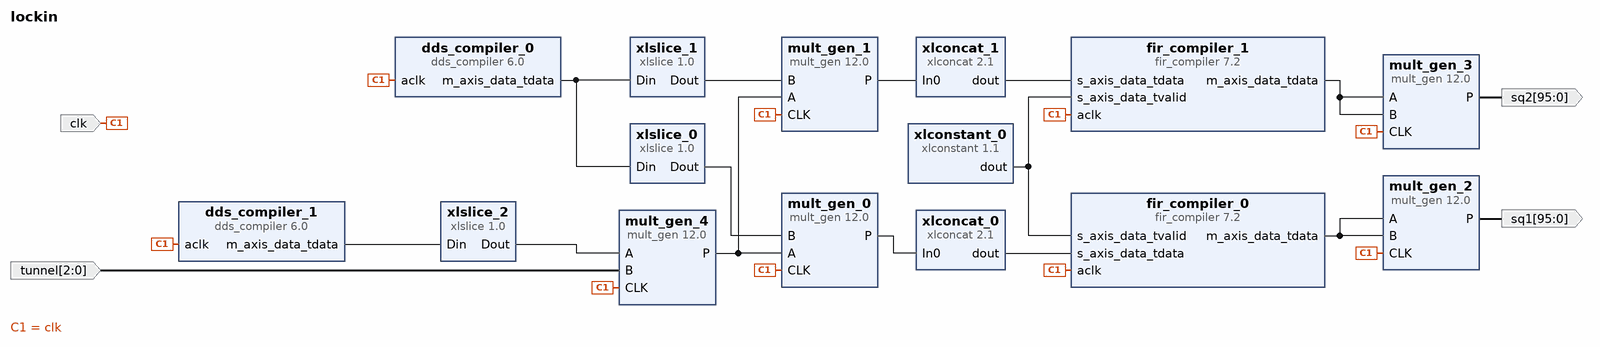
[diagram p0: block diagram of the top level]
# Vivado block design lockin, xc7k70tfbv676-1, Vivado 2017.2
create_bd_design lockin

create_bd_port -dir I -type clk clk
set_property -dict {CONFIG.FREQ_HZ 100000000} [get_bd_ports clk]
create_bd_port -dir O -from 95 -to 0 sq1
create_bd_port -dir O -from 95 -to 0 sq2
create_bd_port -dir I -from 2 -to 0 tunnel

create_bd_cell -type ip -vlnv xilinx.com:ip:dds_compiler:6.0 dds_compiler_0
set_property -dict [list \
  CONFIG.PartsPresent Phase_Generator_and_SIN_COS_LUT \
  CONFIG.Parameter_Entry Hardware_Parameters \
  CONFIG.Noise_Shaping None \
  CONFIG.Phase_Width 16 \
  CONFIG.Output_Width 14 \
  CONFIG.Phase_Increment Fixed \
  CONFIG.Has_Phase_Out true \
  CONFIG.DATA_Has_TLAST Not_Required \
  CONFIG.S_PHASE_Has_TUSER Not_Required \
  CONFIG.M_DATA_Has_TUSER Not_Required \
  CONFIG.Latency 7 \
  CONFIG.Output_Frequency1 0 \
  CONFIG.PINC1 1100110011010 \
] [get_bd_cells dds_compiler_0]
create_bd_cell -type ip -vlnv xilinx.com:ip:xlslice:1.0 xlslice_0
set_property -dict {CONFIG.DIN_TO 16 CONFIG.DIN_FROM 29 CONFIG.DOUT_WIDTH 14} [get_bd_cells xlslice_0]
create_bd_cell -type ip -vlnv xilinx.com:ip:xlslice:1.0 xlslice_1
set_property -dict {CONFIG.DIN_FROM 13 CONFIG.DOUT_WIDTH 14} [get_bd_cells xlslice_1]
create_bd_cell -type ip -vlnv xilinx.com:ip:mult_gen:12.0 mult_gen_0
set_property -dict [list \
  CONFIG.MultType Parallel_Multiplier \
  CONFIG.PortAWidth 14 \
  CONFIG.PortBWidth 14 \
  CONFIG.OptGoal Speed \
] [get_bd_cells mult_gen_0]
create_bd_cell -type ip -vlnv xilinx.com:ip:mult_gen:12.0 mult_gen_1
set_property -dict {CONFIG.PortAWidth 14 CONFIG.PortBWidth 14} [get_bd_cells mult_gen_1]
create_bd_cell -type ip -vlnv xilinx.com:ip:fir_compiler:7.2 fir_compiler_0
set_property -dict [list \
  CONFIG.CoefficientSource COE_File \
  CONFIG.Coefficient_File filtercoeff.coe \
  CONFIG.Coefficient_Sets 1 \
  CONFIG.Coefficient_Reload false \
  CONFIG.RateSpecification Frequency_Specification \
  CONFIG.SamplePeriod 1 \
  CONFIG.Sample_Frequency 100 \
  CONFIG.Clock_Frequency 100 \
  CONFIG.Coefficient_Sign Unsigned \
  CONFIG.Quantization Quantize_Only \
  CONFIG.Coefficient_Width 16 \
  CONFIG.Coefficient_Fractional_Bits 18 \
  CONFIG.Coefficient_Structure Inferred \
  CONFIG.Data_Sign Signed \
  CONFIG.Data_Width 28 \
  CONFIG.Data_Fractional_Bits 0 \
  CONFIG.Output_Rounding_Mode Full_Precision \
  CONFIG.Output_Width 47 \
  CONFIG.Filter_Architecture Systolic_Multiply_Accumulate \
  CONFIG.Optimization_Goal Speed \
  CONFIG.Optimization_Selection All \
  CONFIG.Optimization_List Data_Path_Fanout,Pre-Adder_Pipeline,Coefficient_Fanout,Control_Path_Fanout,Control_Column_Fanout,Control_Broadcast_Fanout,Control_LUT_Pipeline,No_BRAM_Read_First_Mode,Optimal_Column_Lengths,Other \
  CONFIG.ColumnConfig 5 \
] [get_bd_cells fir_compiler_0]
create_bd_cell -type ip -vlnv xilinx.com:ip:fir_compiler:7.2 fir_compiler_1
set_property -dict [list \
  CONFIG.CoefficientSource COE_File \
  CONFIG.Coefficient_File filtercoeff.coe \
  CONFIG.Coefficient_Sets 1 \
  CONFIG.Sample_Frequency 100 \
  CONFIG.Clock_Frequency 100 \
  CONFIG.Coefficient_Sign Unsigned \
  CONFIG.Quantization Quantize_Only \
  CONFIG.Coefficient_Width 16 \
  CONFIG.Coefficient_Fractional_Bits 18 \
  CONFIG.Coefficient_Structure Inferred \
  CONFIG.Data_Width 28 \
  CONFIG.Output_Rounding_Mode Full_Precision \
  CONFIG.Output_Width 47 \
  CONFIG.Filter_Architecture Systolic_Multiply_Accumulate \
  CONFIG.Optimization_Goal Speed \
  CONFIG.Optimization_Selection All \
  CONFIG.Optimization_List Data_Path_Fanout,Pre-Adder_Pipeline,Coefficient_Fanout,Control_Path_Fanout,Control_Column_Fanout,Control_Broadcast_Fanout,Control_LUT_Pipeline,No_BRAM_Read_First_Mode,Optimal_Column_Lengths,Other \
  CONFIG.ColumnConfig 5 \
] [get_bd_cells fir_compiler_1]
create_bd_cell -type ip -vlnv xilinx.com:ip:mult_gen:12.0 mult_gen_2
set_property -dict {CONFIG.PortAWidth 48 CONFIG.PortBWidth 48} [get_bd_cells mult_gen_2]
create_bd_cell -type ip -vlnv xilinx.com:ip:mult_gen:12.0 mult_gen_3
set_property -dict {CONFIG.PortAWidth 48 CONFIG.PortBWidth 48} [get_bd_cells mult_gen_3]
create_bd_cell -type ip -vlnv xilinx.com:ip:mult_gen:12.0 mult_gen_4
set_property -dict {CONFIG.PortAWidth 11 CONFIG.PortBWidth 3} [get_bd_cells mult_gen_4]
create_bd_cell -type ip -vlnv xilinx.com:ip:dds_compiler:6.0 dds_compiler_1
set_property -dict [list \
  CONFIG.PartsPresent Phase_Generator_and_SIN_COS_LUT \
  CONFIG.Parameter_Entry Hardware_Parameters \
  CONFIG.Noise_Shaping None \
  CONFIG.Phase_Width 16 \
  CONFIG.Output_Width 11 \
  CONFIG.Phase_Increment Fixed \
  CONFIG.Has_Phase_Out true \
  CONFIG.DATA_Has_TLAST Not_Required \
  CONFIG.S_PHASE_Has_TUSER Not_Required \
  CONFIG.M_DATA_Has_TUSER Not_Required \
  CONFIG.Latency 4 \
  CONFIG.Output_Frequency1 0 \
  CONFIG.PINC1 1100110011010 \
] [get_bd_cells dds_compiler_1]
create_bd_cell -type ip -vlnv xilinx.com:ip:xlslice:1.0 xlslice_2
set_property -dict {CONFIG.DIN_TO 16 CONFIG.DIN_FROM 26 CONFIG.DOUT_WIDTH 11} [get_bd_cells xlslice_2]
create_bd_cell -type ip -vlnv xilinx.com:ip:xlconcat:2.1 xlconcat_0
set_property -dict {CONFIG.IN0_WIDTH 28 CONFIG.IN1_WIDTH 4} [get_bd_cells xlconcat_0]
create_bd_cell -type ip -vlnv xilinx.com:ip:xlconcat:2.1 xlconcat_1
set_property -dict {CONFIG.IN0_WIDTH 28 CONFIG.IN1_WIDTH 4} [get_bd_cells xlconcat_1]
create_bd_cell -type ip -vlnv xilinx.com:ip:xlconstant:1.1 xlconstant_0

# ---- connections ----

connect_bd_net [get_bd_ports clk] \
  [get_bd_pins dds_compiler_0/aclk] [get_bd_pins mult_gen_0/CLK] [get_bd_pins mult_gen_1/CLK] \
  [get_bd_pins fir_compiler_1/aclk] [get_bd_pins fir_compiler_0/aclk] [get_bd_pins mult_gen_2/CLK] \
  [get_bd_pins mult_gen_3/CLK] [get_bd_pins mult_gen_4/CLK] [get_bd_pins dds_compiler_1/aclk]
connect_bd_net [get_bd_pins xlslice_0/Dout] [get_bd_pins mult_gen_0/B]
connect_bd_net [get_bd_pins xlslice_1/Dout] [get_bd_pins mult_gen_1/B]
connect_bd_net [get_bd_pins fir_compiler_0/m_axis_data_tdata] [get_bd_pins mult_gen_2/A] [get_bd_pins mult_gen_2/B]
connect_bd_net [get_bd_pins fir_compiler_1/m_axis_data_tdata] [get_bd_pins mult_gen_3/A] [get_bd_pins mult_gen_3/B]
connect_bd_net [get_bd_pins dds_compiler_0/m_axis_data_tdata] [get_bd_pins xlslice_0/Din] [get_bd_pins xlslice_1/Din]
connect_bd_net [get_bd_pins dds_compiler_1/m_axis_data_tdata] [get_bd_pins xlslice_2/Din]
connect_bd_net [get_bd_pins xlslice_2/Dout] [get_bd_pins mult_gen_4/A]
connect_bd_net [get_bd_pins mult_gen_4/P] [get_bd_pins mult_gen_0/A] [get_bd_pins mult_gen_1/A]
connect_bd_net [get_bd_pins mult_gen_2/P] [get_bd_ports sq1]
connect_bd_net [get_bd_pins mult_gen_3/P] [get_bd_ports sq2]
connect_bd_net [get_bd_ports tunnel] [get_bd_pins mult_gen_4/B]
connect_bd_net [get_bd_pins mult_gen_0/P] [get_bd_pins xlconcat_0/In0]
connect_bd_net [get_bd_pins mult_gen_1/P] [get_bd_pins xlconcat_1/In0]
connect_bd_net [get_bd_pins xlconcat_0/dout] [get_bd_pins fir_compiler_0/s_axis_data_tdata]
connect_bd_net [get_bd_pins xlconcat_1/dout] [get_bd_pins fir_compiler_1/s_axis_data_tdata]
connect_bd_net [get_bd_pins xlconstant_0/dout] [get_bd_pins fir_compiler_0/s_axis_data_tvalid] [get_bd_pins fir_compiler_1/s_axis_data_tvalid]

validate_bd_design
save_bd_design
